# Altium project LightsDriver.PrjPcb
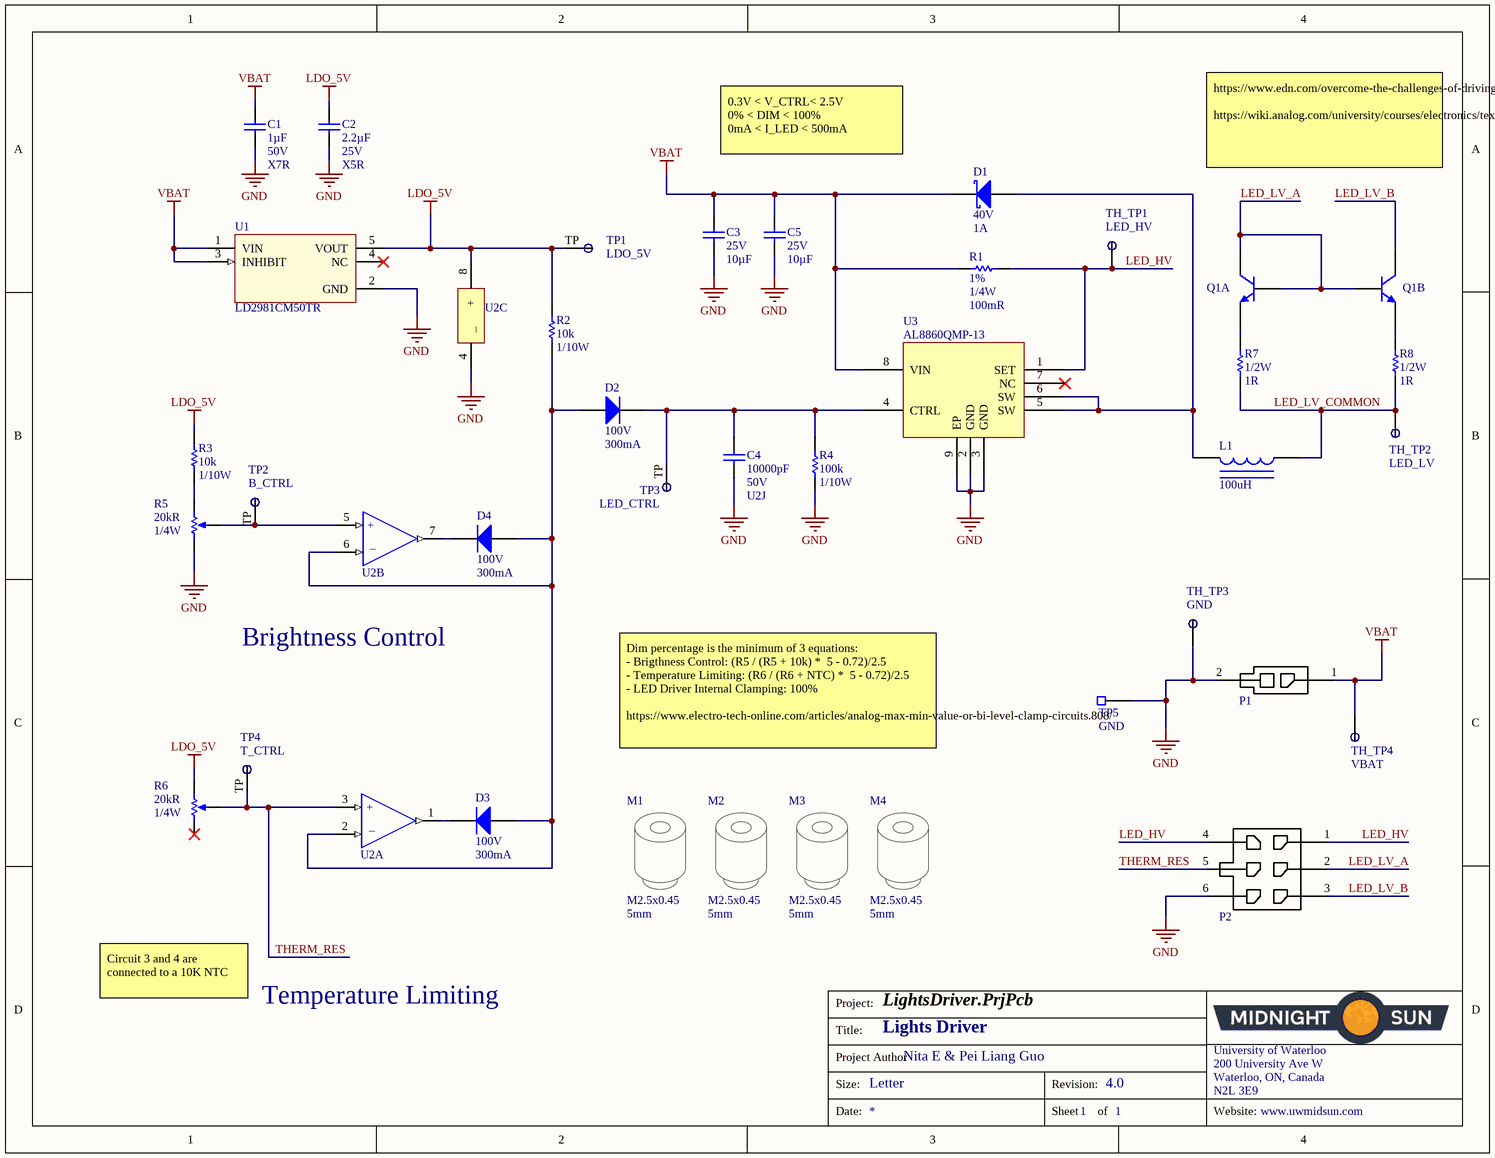
[diagram p0: LightsDriver.SchDoc]
ProjectAuthor: Nita E & Pei Liang Guo; ProjectRevision: 4.0
1 sheet, 37 parts. Net scope: global (net labels, ports and power ports of the same name join across sheets).
Board file: LightsDriver.PcbDoc

## Sheet LightsDriver.SchDoc: Lights Driver
size Letter; Organization: Midnight Sun Solar Rayce Car Team; Address1: University of Waterloo; Address2: 200 University Ave W; Address3: Waterloo, ON, Canada; Address4: N2L 3E9; Revision: 4.0; SheetNumber: 1; SheetTotal: 1; Website: www.uwmidsun.com

### Parts
C1  Capacitance: 1µF  Voltage: 50V  Temperature Coefficient: X7R  [CAP, 0603]  (hidden comment: CAP CER 1UF 50V 10% X7R 0603)
C2  Capacitance: 2.2µF  Voltage: 25V  Temperature Coefficient: X5R  [CAP, 0603]  (hidden comment: CAP CER 2.2UF 25V 10% X5R 0603)
C3  Voltage - Rated: 25V  Capacitance: 10µF  [CAP, 0805]  (hidden comment: CAP CER 10uF 25V 10% X5R 0805)
C4  Capacitance: 10000pF  Voltage: 50V  Temperature Coefficient: U2J  [CAP, 0603]  (hidden comment: CAP CER 10nF 50V 5% X7R 0603)
C5  Voltage - Rated: 25V  Capacitance: 10µF  [CAP, 0805]  (hidden comment: CAP CER 10uF 25V 10% X5R 0805)
D1  Max Reverse Voltage (DC): 40V  Average Rectified Current: 1A  [DIODE SOD123]  (hidden comment: DIODE SCHOTTKY 40V 1A SOD123F)
D2  Max Repetitive Reverse Voltage (Vrrm): 100V  Forward Current: 300mA  [DIODE GEN PURP 100V 300MA SOD123]  (hidden comment: DIODE GEN PURP 100V 300MA SOD123)
D3  Max Repetitive Reverse Voltage (Vrrm): 100V  Forward Current: 300mA  [DIODE GEN PURP 100V 300MA SOD123]  (hidden comment: DIODE GEN PURP 100V 300MA SOD123)
D4  Max Repetitive Reverse Voltage (Vrrm): 100V  Forward Current: 300mA  [DIODE GEN PURP 100V 300MA SOD123]  (hidden comment: DIODE GEN PURP 100V 300MA SOD123)
L1  Inductance: 100uH  [IND 100UH 1.2A 220MOHM SMD]  (hidden comment: IND 100UH 1.2A 220MOHM SMD)
M1  Screw-Thread Size: M2.5x0.45  Standoff Height: 5mm  [M2.5 Standoff]  (hidden comment: STANDOFF RND M2.5X0.45 STEEL 5MM)
M2  Screw-Thread Size: M2.5x0.45  Standoff Height: 5mm  [M2.5 Standoff]  (hidden comment: STANDOFF RND M2.5X0.45 STEEL 5MM)
M3  Screw-Thread Size: M2.5x0.45  Standoff Height: 5mm  [M2.5 Standoff]  (hidden comment: STANDOFF RND M2.5X0.45 STEEL 5MM)
M4  Screw-Thread Size: M2.5x0.45  Standoff Height: 5mm  [M2.5 Standoff]  (hidden comment: STANDOFF RND M2.5X0.45 STEEL 5MM)
P1  TO PWR DISTR  [CONN, 2POS MICRO-FIT R/A 2ROW]  (value not drawn)
P2  CONN 6POS MICRO-FIT R/A 2ROW 3mm  [CONN, 6POS MICRO-FIT R/A 2ROW]  (value not drawn)
Q1  BJT NPN DUAL 80V 1A 6-TSOP  [TSOP6 (SOT457)]  (value not drawn)  (parts A,B of 2)
R1  Tolerance: 1%  Power Rating: 1/4W  Resistance: 100mR  [RES 1206]  (hidden comment: RES 0.1 OHM 1% 1/4W 1206)
R2  Resistance: 10k  Power: 1/10W  [RES, 0603]  (hidden comment: RES 10K OHM 1% 1/10W 0603)
R3  Resistance: 10k  Power: 1/10W  [RES, 0603]  (hidden comment: RES 10K OHM 1% 1/10W 0603)
R4  Resistance: 100k  Power: 1/10W  [RES, 0603]  (hidden comment: RES 100K OHM 5% 1/8W 0603)
R5  Resistance: 20kR  Power Rating: 1/4W  [POT TRIMMER 20K]  (hidden comment: POT 20k OHM 20% 1/4W SMD)
R6  Resistance: 20kR  Power Rating: 1/4W  [POT TRIMMER 20K]  (hidden comment: POT 20k OHM 20% 1/4W SMD)
R7  Max Power Dissipation: 1/2W  Resistance: 1R  [RES 1206]  (hidden comment: RES 1 OHM 1% 1/2W 1206)
R8  Max Power Dissipation: 1/2W  Resistance: 1R  [RES 1206]  (hidden comment: RES 1 OHM 1% 1/2W 1206)
TH_TP1  LED_HV  [Thru Test Point]
TH_TP2  LED_LV  [Thru Test Point]
TH_TP3  GND  [Thru Test Point]
TH_TP4  VBAT  [Thru Test Point]
TP1  LDO_5V  [Test Point]  (no BOM)
TP2  B_CTRL  [Test Point]  (no BOM)
TP3  LED_CTRL  [Test Point]  (no BOM)
TP4  T_CTRL  [Test Point]  (no BOM)
TP5  GND  [TEST POINT 0603 SMD]
U1  Manufacturer Part Number 1: LD2981CM50TR  [SOT95P280X145-5N]  (hidden comment: IC REG LDO 5V 0.1A SOT23-5)
U2  IC OP AMP DUAL GP RR 10MHZ 8-VSSOP  [IC OP AMP DUAL 8-VSSOP]  (value not drawn)  (parts A,B,C of 3)
U3  Manufacturer Part Number: AL8860QMP-13  [IC LED DRIVER AL8860Q 8-MSOP-EP]  (hidden comment: IC LED DRIVER AL8860Q MSOP-8EP)

### Nets
GND: C1.2 C2.2 C3.2 C4.2 C5.2 P1.2 P2.6 R4.2 R5.1(TOP) TH_TP3.TH_TP TP5.1 U1.2(GND) U2.4(_) U3.2(GND) U3.3(GND) U3.9(EP)
LDO_5V: C2.1 R2.1 R3.1 R6.3(BOT) TP1.TP U1.5(VOUT) U2.8(+)
VBAT: C1.1 C3.1 C5.1 D1.1 P1.1 R1.1 TH_TP4.TH_TP U1.1(VIN) U1.3(INHIBIT) U3.8(VIN)
LED_HV: P2.1 P2.4 R1.2 TH_TP1.TH_TP U3.1(SET)
LED_LV_A: P2.2 Q1.1(B1) Q1.2(B2) Q1.6(C1)
LED_LV_B: P2.3 Q1.3(C2)
LED_LV_COMMON: L1.1 R7.2 R8.2 TH_TP2.TH_TP
THERM_RES: P2.5 R6.2(TAP) TP4.TP U2.3(+IN_A)
NetC4_1: C4.1 D2.1(CATHODE) R4.1 TP3.TP U3.4(CTRL)
NetD1_2: D1.2 L1.2 U3.5(SW) U3.6(SW)
NetD2_2: D2.2(ANODE) D3.2(ANODE) D4.2(ANODE) R2.2 U2.2(-IN_A) U2.6(-IN_B)
NetD3_1: D3.1(CATHODE) U2.1(OUT_A)
NetD4_1: D4.1(CATHODE) U2.7(OUT_B)
NetQ1_4: Q1.4(E2) R8.1
NetQ1_5: Q1.5(E1) R7.1
NetR3_2: R3.2 R5.3(BOT)
NetR5_2: R5.2(TAP) TP2.TP U2.5(+IN_B)

Not connected (* = marked no-connect by the designer): R6 1(TOP)*; U1 4(NC)*; U3 7(NC)*

### Notes on the sheet
- 0.3V < V_CTRL< 2.5V
  0% < DIM < 100%
  0mA < I_LED < 500mA
- https://www.edn.com/overcome-the-challenges-of-driving-parallel-led-strings/
  https://wiki.analog.com/university/courses/electronics/text/chapter-11
- Brightness Control
- Dim percentage is the minimum of 3 equations:
  - Brigthness Control: (R5 / (R5 + 10k) *  5 - 0.72)/2.5
  - Temperature Limiting: (R6 / (R6 + NTC) *  5 - 0.72)/2.5
  - LED Driver Internal Clamping: 100%
  https://www.electro-tech-online.com/articles/analog-max-min-value-or-bi-level-clamp-circuits.808/
- Circuit 3 and 4 are connected to a 10K NTC
- Temperature Limiting
- Project:
- Title:
- Size:
- Project Author
- Letter
- Revision:
- University of Waterloo
- 200 University Ave W
- Waterloo, ON, Canada
- N2L 3E9
- Date:
- Sheet
- of
- Website:

### Library data of the parts
C1 = CAP CER 1UF 50V 10% X7R 0603: 1µF ±10% 50V Ceramic Capacitor X7R 0603 (1608 Metric); Manufacturer 1: Taiyo Yuden; Manufacturer Part Number 1: UMK107AB7105KA-T; Supplier 1: Digi-Key; Supplier Part Number 1: 587-3247-1-ND; Packaging: Cut Tape (CT); Part Status: Active; Operating Temperature: -55°C ~ 125°C; Ratings: -; Mounting Type: Surface Mount, MLCC; Package / Case: 0603 (1608 Metric); Size / Dimension: 0.063" L x 0.031" W (1.60mm x 0.80mm); Height - Seated (Max): -; Thickness (Max): 0.037" (0.95mm); Lead Spacing: -; Lead Style: -; ComponentLink1URL: http://www.yuden.co.jp/productdata/catalog/en/mlcc_all_e.pdf; ComponentLink1Description: http://www.yuden.co.jp/productdata/catalog/en/mlcc_all_e.pdf; Tolerance: ±10%
C2 = CAP CER 2.2UF 25V 10% X5R 0603: 2.2µF ±10% 25V Ceramic Capacitor X5R 0603 (1608 Metric); Manufacturer 1: Murata Electronics North America; Manufacturer Part Number 1: GRM188R61E225KA12D; Supplier 1: Digi-Key; Supplier Part Number 1: 490-10731-1-ND; Packaging: Cut Tape (CT); Part Status: Active; Operating Temperature: -55°C ~ 85°C; Ratings: -; Mounting Type: Surface Mount, MLCC; Package / Case: 0603 (1608 Metric); Size / Dimension: 0.063" L x 0.031" W (1.60mm x 0.80mm); Height - Seated (Max): -; Thickness (Max): 0.035" (0.90mm); Lead Spacing: -; Lead Style: -; ComponentLink1URL: http://www.murata.com/~/media/webrenewal/support/library/catalog/products/capacitor/mlcc/c02e.ashx; ComponentLink1Description: http://www.murata.com/~/media/webrenewal/support/library/catalog/products/capacitor/mlcc/c02e.ashx; Tolerance: ±10%
C3 C5 = CAP CER 10uF 25V 10% X5R 0805: 10µF ±10% 25V Ceramic Capacitor X5R 0805 (2012 Metric); Manufacturer: Murata Electronics North America; Manufacturer Part Number: GRM21BR61E106KA73L; Supplier 1: Digi-Key; RoHS: RoHS Compliant; Category: Capacitors; Stock 1: 1695157; Packaging: Cut Tape (CT); Part Status: Active; Tolerance: ±10%; Temperature Coefficient: X5R; Operating Temperature: -55°C ~ 85°C; Features: -; Ratings: -; Applications: General Purpose; Mounting Type: Surface Mount, MLCC; Package / Case: 0805 (2012 Metric); Size / Dimension: 0.079" L x 0.049" W (2.00mm x 1.25mm); Height - Seated (Max): -; Thickness (Max): 0.053" (1.35mm); Lead Spacing: -; Lead Style: -; ComponentLink1URL: http://search.murata.co.jp/Ceramy/image/img/A01X/G101/ENG/GRM21BR61E106KA73-01.pdf; ComponentLink1Description: http://search.murata.co.jp/Ceramy/image/img/A01X/G101/ENG/GRM21BR61E106KA73-01.pdf; Supplier Part Number 1: 490-5523-1-ND; Pricing 1: 1=0.3, 10=0.214, 100=0.1008, 500=0.07068, 1000=0.05851 (CAD)
C4 = CAP CER 10nF 50V 5% X7R 0603: 10000pF ±5% 50V Ceramic Capacitor U2J 0603 (1608 Metric); Manufacturer 1: KEMET; Manufacturer Part Number 1: C0603C103J5JAC7867; Supplier 1: Digi-Key; Supplier Part Number 1: 399-13384-1-ND; Packaging: Cut Tape (CT); Part Status: Active; Operating Temperature: -55°C ~ 125°C; Ratings: -; Failure Rate: -; Mounting Type: Surface Mount, MLCC; Package / Case: 0603 (1608 Metric); Size / Dimension: 0.063" L x 0.032" W (1.60mm x 0.80mm); Height - Seated (Max): -; Thickness (Max): 0.034" (0.87mm); Lead Spacing: -; Lead Style: -; ComponentLink1URL: http://www.kemet.com/docfinder?Partnumber=C0603C103J5JAC7867; ComponentLink1Description: http://www.kemet.com/docfinder?Partnumber=C0603C103J5JAC7867; Tolerance: ±5%
D1 = DIODE SCHOTTKY 40V 1A SOD123F: Manufacturer: ON Semiconductor / Fairchild; Manufacturer Part Number: SS14FL; Reverse Recovery Time: 5.695ns; Element Configuration: Single; Max Forward Surge Current (Ifsm): 40A; Supplier 1: Digi-Key; RoHS: Yes; Category: Rectifier Diodes; Stock 1: 36912; Pricing 1: 1=0.25000, 10=0.20900, 25=0.17480, 100=0.08540, 250=0.08400, 500=0.07120, 1000=0.04947 (USD); Mount: Surface Mount; Case/Package: SOD; Weight: 0.0276g; Packaging: Tape and Reel; Max Repetitive Reverse Voltage (Vrrm): 40V; ComponentLink1URL: http://www.farnell.com/datasheets/2552650.pdf?src-supplier=Farnell; ComponentLink1Description: http://www.farnell.com/datasheets/2552650.pdf?src-supplier=Farnell; ComponentLink2URL: https://www.onsemi.com/pub/Collateral/SS14FL-D.PDF?src-supplier=Digi-Key; ComponentLink2Description: https://www.onsemi.com/pub/Collateral/SS14FL-D.PDF?src-supplier=Digi-Key; ComponentLink3URL: https://www.fairchildsemi.com/datasheets/SS/SS13FL.pdf?src-supplier=Digi-Key; ComponentLink3Description: https://www.fairchildsemi.com/datasheets/SS/SS13FL.pdf?src-supplier=Digi-Key; Supplier Part Number 1: SS14FLCT-ND
D2-D4 = DIODE GEN PURP 100V 300MA SOD123: Diode Standard 100V 300mA (DC) Surface Mount SOD-123; Manufacturer: Diodes Zetex; Manufacturer Part Number: 1N4148WQ-7-F; Max Surge Current: 2A; Forward Voltage: 1.25V; Element Configuration: Single; Recovery Time: 4ns; Peak Reverse Current: 50uA; Max Power Dissipation: 400mW; Supplier 1: Digi-Key; Stock 1: 229; Pricing 1: 1=0.22, 10=0.196, 100=0.107, 500=0.0658, 1000=0.0449 (USD); Mount: Surface Mount; Case/Package: SOD-123-2; Number of Pins: 2; Weight: 0.000353oz; Contact Plating: Tin,Matte; Min Operating Temperature: -65°C; Max Operating Temperature: 150°C; Packaging: Tape and Reel; Peak Non-Repetitive Surge Current: 2A; Package Quantity: 3000; Reverse Recovery Time: 4ns; Lead Free: Lead Free; ComponentLink1URL: http://components.arrow.com/part/dataview/0323_07206809; ComponentLink1Description: http://components.arrow.com/part/dataview/0323_07206809; ComponentLink2URL: http://www.diodes.com/datasheets/ds30086.pdf; ComponentLink2Description: http://www.diodes.com/datasheets/ds30086.pdf; ComponentLink3URL: http://www.mouser.com/ds/2/115/ds30086-318161.pdf; ComponentLink3Description: http://www.mouser.com/ds/2/115/ds30086-318161.pdf; Supplier Part Number 1: 1N4148WQ-7-FDICT-ND
L1 = IND 100UH 1.2A 220MOHM SMD: Inductor Power Shielded Wirewound 100uH 30% 100KHz 26Q-Factor Ferrite 1.2A 220mOhm DCR Automotive T/R; Manufacturer: Bourns; Manufacturer Part Number: SRU1048A-101Y; DC Resistance (DCR): 220mR; Self Resonant Frequency: 5MHz; Saturation Current: 1A; Supplier 1: Digi-Key; RoHS: Yes; Category: Fixed Inductors; Stock 1: 69; Pricing 1: 1=1.17000, 10=1.08400, 100=0.78370 (USD); Mount: Surface Mount; Case/Package: Nonstandard; Core Material: Ferrite; Min Operating Temperature: -40°C; Max Operating Temperature: 125°C; Composition: Wirewound; Test Frequency: 100kHz; Military Standard: Not; RMS Current (Irms): 1.2A; Max DC Current: 1.2A; Inductance Tolerance: 30%; Packaging: Cut Tape; Tolerance: 30%; Shielding: Shielded; Package Quantity: 600; Current Rating: 1.2A; Length: 0.394inch; Height: 4.8mm; Height - Seated (Max): 0.201inch; Depth: 10.3mm; Width: 0.394inch; Ratings: AEC-Q200; REACH SVHC: No SVHC; ComponentLink1URL: https://datasheet.ciiva.com/48684/sru1048a-48684678.pdf?src-supplier=Avnet; ComponentLink1Description: https://datasheet.ciiva.com/48684/sru1048a-48684678.pdf?src-supplier=Avnet; ComponentLink2URL: https://datasheet.ciiva.com/41859/sru1048a-41859752.pdf?src-supplier=Digi-Key; ComponentLink2Description: https://datasheet.ciiva.com/41859/sru1048a-41859752.pdf?src-supplier=Digi-Key; Supplier Part Number 1: SRU1048A-101YCT-ND
M1-M4 = STANDOFF RND M2.5X0.45 STEEL 5MM: Manufacturer: Wurth Electronics; Manufacturer Part Number: 9774050151R; Plating: Tin; Threaded/Unthreaded: Threaded; Outside Diameter: 0.201inch; Supplier 1: Digi-Key; RoHS: Yes; Stock 1: 24846; Pricing 1: 1 = 1.09000, 10 = 1.03000, 50 = 0.91800, 100 = 0.84000 (USD); Material: Steel; Length: 0.252inch; REACH SVHC: Unknown; Supplier Part Number 1: 732-7095-1-ND
P1 = CONN 2POS MICRO-FIT R/A 2ROW 3mm: Header Connector, Pcb Mount, Recept, 2 Contacts, Pin, 0.118 Pitch, R Angle Pc Tail Terminal; Manufacturer: Molex; Manufacturer Part Number: 43045-0221; Connector Type: Male Pin; Contact Resistance: 10mR; Number of Positions: 2; Current Rating: 5A; Voltage Rating: 250V; Max Voltage Rating (DC): 250.25kV; Gender: Male; Pitch: 3mm; Row Spacing: 0.118inch; Glow Wire Compliant: Compliant; Supplier 1: Digi-Key; RoHS: Yes; Category: Headers and Wire Housings; Stock 1: 1557; Pricing 1: 1=1.19000, 10=1.04400, 100=0.90070, 500=0.73692, 3168=0.59363, 6336=0.57316, 12672=0.53222 (USD); Mount: Through Hole; Case/Package: Metal; Housing Material: Thermoplastic; Contact Material: Brass; Contact Plating: Tin; Color: Black; Min Operating Temperature: -40°C; Max Operating Temperature: 105°C; Number of Rows: 2; Packaging: Tray; Fastening Type: Ramp; Termination: Solder; Number of Contacts: 2; Orientation: Right Angle; Package Quantity: 1; Number of Circuits: 2; Halogen Free: Low Halogen; ComponentLink1URL: https://datasheet.ciiva.com/5152/0430450221-pcb-headers-142766-5152032.pdf?src-supplier=Mouser; ComponentLink1Description: https://datasheet.ciiva.com/5152/0430450221-pcb-headers-142766-5152032.pdf?src-supplier=Mouser; ComponentLink2URL: https://datasheet.ciiva.com/16725/0430450221-pcb-headers-16725479.pdf?src-supplier=Avnet+Europe; ComponentLink2Description: https://datasheet.ciiva.com/16725/0430450221-pcb-headers-16725479.pdf?src-supplier=Avnet+Europe; ComponentLink3URL: https://datasheet.ciiva.com/11752/0900766b80d438f8-11752889.pdf?src-supplier=RSComponents; ComponentLink3Description: https://datasheet.ciiva.com/11752/0900766b80d438f8-11752889.pdf?src-supplier=RSComponents; ComponentLink4URL: https://datasheet.ciiva.com/30062/187650430450221-pcb-headers-30062367.pdf?src-supplier=Onlinecomponents.com; ComponentLink4Description: https://datasheet.ciiva.com/30062/187650430450221-pcb-headers-30062367.pdf?src-supplier=Onlinecomponents.com; ComponentLink5URL: https://datasheet.ciiva.com/7920/1629737-7920746.pdf?src-supplier=Element14; ComponentLink5Description: https://datasheet.ciiva.com/7920/1629737-7920746.pdf?src-supplier=Element14; ComponentLink6URL: https://datasheet.ciiva.com/726/430450221-sd-726236.pdf?src-supplier=Digi-Key; ComponentLink6Description: https://datasheet.ciiva.com/726/430450221-sd-726236.pdf?src-supplier=Digi-Key; Supplier Part Number 1: WM2672-ND
P2 = CONN 6POS MICRO-FIT R/A 2ROW 3mm: Conn Wire to Board HDR 6 POS 3mm Solder RA Thru-Hole Micro-Fit 3.0™ Tray; Manufacturer: Molex; Manufacturer Part Number: 043045-0621; Voltage Rating (DC): 250V; Gender: Female; Number of Circuits: 6; Insulation Resistance: 1GR; Current Rating: 5A; Contact Resistance: 10mR; Connector Type: Male Pin; Row Spacing: 0.118inch; Glow Wire Compliant: Compliant; Supplier 1: Digi-Key; RoHS: Yes; Category: Headers and Wire Housings; Stock 1: 170; Pricing 1: 1=1.89000, 10=1.71500, 100=1.46960, 500=1.22466, 1000=1.04970, 5000=0.93073, 10000=0.90974 (USD); Mount: Through Hole; Housing Material: Polymer; Contact Plating: Tin; Contact Material: Brass; Color: Black; Housing Color: Black; Min Operating Temperature: -40°C; Max Operating Temperature: 105°C; Orientation: Right Angle; Number of Rows: 2; Packaging: Tray; Number of Positions: 6; Termination: Solder; Number of Contacts: 6; Fastening Type: Ramp; Length: 13.15mm; Pitch: 3mm; Depth: 12.2mm; Flammability Rating: UL94 V-0; Halogen Free: Low Halogen; ComponentLink1URL: http://components.arrow.com/part/dataview/2943185S8703233N3303?src-supplier=Arrow; ComponentLink1Description: http://components.arrow.com/part/dataview/2943185S8703233N3303?src-supplier=Arrow; ComponentLink2URL: http://components.arrow.com/part/dataview/0323_01056240?src-supplier=Arrow+Europe; ComponentLink2Description: http://components.arrow.com/part/dataview/0323_01056240?src-supplier=Arrow+Europe; ComponentLink3URL: https://www.molex.com/pdm_docs/sd/430450221_sd.pdf?src-supplier=Digi-Key; ComponentLink3Description: https://www.molex.com/pdm_docs/sd/430450221_sd.pdf?src-supplier=Digi-Key; Supplier Part Number 1: WM2674-ND
Q1 = BJT NPN DUAL 80V 1A 6-TSOP: Bipolar (BJT) Transistor Array 2 PNP (Dual) Matched Pair 80V 1A 140MHz 500mW Surface Mount 6-TSOP; Manufacturer: Nexperia; Manufacturer Part Number: BCM56DSF; Supplier 1: Digi-Key; RoHS: No; Stock 1: 9949; Pricing 1: 1=0.35000, 10=0.28200, 25=0.25800, 100=0.16200, 250=0.16020, 500=0.15000, 1000=0.10200, 2500=0.09780, 5000=0.09000 (USD); Supplier Part Number 1: 1727-7829-1-ND
R1 = RES 0.1 OHM 1% 1/4W 1206: Res Thick Film 1206 0.1 Ohm 1% 0.25W(1/4W) ±600ppm/C Molded SMD Paper T/R; Manufacturer: Yageo; Manufacturer Part Number: RL1206FR-070R1L; Max Power Dissipation: 250mW; Temperature Coefficient: 600ppm/°C; Supplier 1: Digi-Key; RoHS: Yes; Category: Chip SMD Resistors; Stock 1: 37786; Pricing 1: 1=0.38000, 10=0.29200, 100=0.12250, 1000=0.06760, 2500=0.06338 (USD); Case/Package: 1206; Contact Plating: Tin,Lead; Case Code (Metric): 3216; Case Code (Imperial): 1206; Min Operating Temperature: -55°C; Max Operating Temperature: 125°C; Features: Moisture Resistant; Composition: Thick Film; Number of Terminations: 2; Termination: SMD/SMT; Military Standard: Not; Package Quantity: 1; Packaging: Tape and Reel; Length: 3.1mm; Height: 0.026inch; Depth: 1.6mm; Width: 0.063inch; Lead Free: Lead Free; REACH SVHC: Unknown; ComponentLink1URL: https://datasheet.ciiva.com/5558/pyu-rl-hp-521-rohs-l-2-5558071.pdf?src-supplier=Mouser; ComponentLink1Description: https://datasheet.ciiva.com/5558/pyu-rl-hp-521-rohs-l-2-5558071.pdf?src-supplier=Mouser; ComponentLink2URL: https://datasheet.ciiva.com/22699/877049-22699038.pdf?src-supplier=Element14; ComponentLink2Description: https://datasheet.ciiva.com/22699/877049-22699038.pdf?src-supplier=Element14; Supplier Part Number 1: 311-0.1LWCT-ND
R2 R3 = RES 10K OHM 1% 1/10W 0603: RES SMD 10K OHM 1% 1/10W 0603; Manufacturer 1: Yageo; Manufacturer Part Number 1: RC0603FR-0710KL; Temperature Coefficient: ±100ppm/°C; Supplier 1: Digi-Key; Supplier Part Number 1: 311-10.0KHRCT-ND; Packaging: Cut Tape (CT); Part Status: Active; Composition: Thick Film; Operating Temperature: -55°C ~ 155°C; Package / Case: 0603 (1608 Metric); Supplier Device Package: 0603; Size / Dimension: 0.063" L x 0.031" W (1.60mm x 0.80mm); Height - Seated (Max): 0.022" (0.55mm); Failure Rate: -; ComponentLink1URL: http://www.yageo.com/documents/recent/PYu-RC_Group_51_RoHS_L_7.pdf; ComponentLink1Description: http://www.yageo.com/documents/recent/PYu-RC_Group_51_RoHS_L_7.pdf; Tolerance: ±1%
R4 = RES 100K OHM 5% 1/8W 0603: RES SMD 100K OHM 5% 1/10W 0603; Manufacturer 1: Yageo; Manufacturer Part Number 1: RC0603JR-07100KL; Temperature Coefficient: ±100ppm/°C; Supplier 1: Digi-Key; Supplier Part Number 1: 311-100KGRCT-ND; Packaging: Cut Tape (CT); Part Status: Active; Composition: Thick Film; Operating Temperature: -55°C ~ 155°C; Package / Case: 0603 (1608 Metric); Supplier Device Package: 0603; Size / Dimension: 0.063" L x 0.031" W (1.60mm x 0.80mm); Height - Seated (Max): 0.022" (0.55mm); Failure Rate: -; ComponentLink1URL: http://www.yageo.com/documents/recent/PYu-RC_Group_51_RoHS_L_7.pdf; ComponentLink1Description: http://www.yageo.com/documents/recent/PYu-RC_Group_51_RoHS_L_7.pdf; Tolerance: ±5%
R5 R6 = POT 20k OHM 20% 1/4W SMD: 20 kOhms 0.25W, 1/4W Gull Wing Surface Mount Trimmer Potentiometer Cermet 1 Turn Top Adjustment; Manufacturer: TT BI; Manufacturer Part Number: 23BR20KLFTR; Voltage Rating: 200V; Max Power Dissipation: 250mW; Number of Turns: 1; Insulation Resistance: 100MR; Temperature Coefficient: 100ppm/°C; Supplier 1: Digi-Key; RoHS: Yes; Category: Variable Resistors and Potentiometers; Stock 1: 2071; Pricing 1: 1=1.27000, 10=1.12200, 25=1.01000, 50=0.97240, 100=0.93500, 250=0.87892 (USD); Mount: Surface Mount; Weight: 0.004938oz; Min Operating Temperature: -55°C; Max Operating Temperature: 125°C; Package Quantity: 1; Tolerance: 20%; Packaging: Tape and Reel; Voltage Rating (DC): 200V; Termination: Gull Wing; Military Standard: Not; Composition: Cermet; Type: Potentiometer; Length: 5mm; Height: 0.106inch; Width: 4.5mm; Depth: 6.2mm; Radiation Hardening: No; REACH SVHC: No SVHC; Lead Free: Lead Free; ComponentLink1URL: https://datasheet.ciiva.com/3890/42287794s7870631n1290-3890844.pdf?src-supplier=Arrow; ComponentLink1Description: https://datasheet.ciiva.com/3890/42287794s7870631n1290-3890844.pdf?src-supplier=Arrow; ComponentLink2URL: https://datasheet.ciiva.com/1130/4708-1130034.pdf?src-supplier=Element14; ComponentLink2Description: https://datasheet.ciiva.com/1130/4708-1130034.pdf?src-supplier=Element14; ComponentLink3URL: https://datasheet.ciiva.com/14186/tz23-b-dat-e-14186231.pdf?src-supplier=Distrelec; ComponentLink3Description: https://datasheet.ciiva.com/14186/tz23-b-dat-e-14186231.pdf?src-supplier=Distrelec; Supplier Part Number 1: 987-1016-1-ND
R7 R8 = RES 1 OHM 1% 1/2W 1206: BOURNS - CRM1206AFX-1R00ELF - RES, 1R, 1%, 1206, THICK FILM; Temperature Coefficient: 100ppm/°C; Supplier 1: Digi-Key; Manufacturer: Bourns; Manufacturer Part Number: CRM1206AFX-1R00ELF; RoHS: No; Stock 1: 9624; Pricing 1: 1=0.14000, 10=0.12100, 100=0.04730, 1000=0.01980, 2500=0.01815 (USD); Case/Package: 1206; Case Code (Imperial): 1206; Case Code (Metric): 3216; Min Operating Temperature: -55°C; Max Operating Temperature: 155°C; Composition: Thick Film; Features: Automotive AEC-Q200,Anti-Sulfur; Packaging: Cut Tape; Number of Terminations: 2; ComponentLink1URL: http://www.farnell.com/datasheets/2552937.pdf?src-supplier=Farnell; ComponentLink1Description: http://www.farnell.com/datasheets/2552937.pdf?src-supplier=Farnell; ComponentLink2URL: https://www.bourns.com/docs/product-datasheets/crm-a.pdf?src-supplier=Digi-Key; ComponentLink2Description: https://www.bourns.com/docs/product-datasheets/crm-a.pdf?src-supplier=Digi-Key; ComponentLink3URL: http://www.farnell.com/datasheets/2552937.pdf?src-supplier=Newark; ComponentLink3Description: http://www.farnell.com/datasheets/2552937.pdf?src-supplier=Newark; ComponentLink4URL: http://www.farnell.com/datasheets/2552937.pdf?src-supplier=Element14; ComponentLink4Description: http://www.farnell.com/datasheets/2552937.pdf?src-supplier=Element14; Supplier Part Number 1: CRM1206AFX-1R00ELFCT-ND; Tolerance: 1%
TH_TP1-TH_TP4 = Thru Test Point
TP1-TP4 = Test Point
TP5 = Test Point 0603 SMD: Manufacturer 1: TE Connectivity; Manufacturer Part Number 1: 1625854-3; Description 1: Thick Film Resistors - SMD 2000; Resistance: 0mR; Supplier 1: Digi-Key; Supplier Part Number 1: A106145CT-ND; Stock 1: 212628; Pricing 1: 1=0.22, 10=0.211, 25=0.18, 50=0.1574, 100=0.1462, 250=0.12932, 500=0.12368, 1000=0.1012 (USD); Mount: Surface Mount; Case/Package: 0603; Colour: Natural; Case Code (Imperial): 0603; Case Code (Metric): 1608; Min Operating Temperature: -55°C; Max Operating Temperature: 125°C; Packaging: Tape and Reel; Termination: SMD/SMT; Package Quantity: 2000; Military Standard: Not; Length: 1.6mm; Height: 1.15mm; Width: 0.8mm; Depth: 0.8mm; Radiation Hardening: No; ComponentLink1URL: https://datasheet.ciiva.com/30100/1773266-a-30100967.pdf; ComponentLink1Description: https://datasheet.ciiva.com/30100/1773266-a-30100967.pdf; ComponentLink2URL: https://datasheet.ciiva.com/8914/eng-ds-1773266-a-8914634.pdf; ComponentLink2Description: https://datasheet.ciiva.com/8914/eng-ds-1773266-a-8914634.pdf; ComponentLink3URL: https://datasheet.ciiva.com/6439/eng-ds-1773266-a-6439163.pdf; ComponentLink3Description: https://datasheet.ciiva.com/6439/eng-ds-1773266-a-6439163.pdf; ComponentLink4URL: https://datasheet.ciiva.com/6439/eng-ds-1773266-a-6439164.pdf; ComponentLink4Description: https://datasheet.ciiva.com/6439/eng-ds-1773266-a-6439164.pdf; ComponentLink5URL: https://datasheet.ciiva.com/6439/eng-ds-1773266-a-6439165.pdf; ComponentLink5Description: https://datasheet.ciiva.com/6439/eng-ds-1773266-a-6439165.pdf
U1 = IC REG LDO 5V 0.1A SOT23-5: Linear Voltage Regulator IC Positive Fixed Output 5V 100mA SOT-23-5; Manufacturer 1: STMicroelectronics; Voltage - Dropout (Typical): 0.18V @ 100mA; Voltage - Input: Up to 16V; Supplier 1: Digi-Key; Supplier Part Number 1: 497-7787-1-ND; Packaging: Cut Tape (CT); Part Status: Active; Regulator Topology: Positive Fixed; Voltage - Output: 5V; Current - Output: 100mA; Current - Limit (Min): -; Operating Temperature: -40°C ~ 125°C; Mounting Type: Surface Mount; Package / Case: SC-74A, SOT-753; Supplier Device Package: SOT-23-5; ComponentLink1URL: http://www.st.com/content/ccc/resource/technical/document/datasheet/group1/b7/b5/a1/83/9c/bd/4a/90/CD00001635/files/CD00001635.pdf/jcr:content/translations/en.CD00001635.pdf; ComponentLink1Description: http://www.st.com/content/ccc/resource/technical/document/datasheet/group1/b7/b5/a1/83/9c/bd/4a/90/CD00001635/files/CD00001635.pdf/jcr:content/translations/en.CD00001635.pdf
U2 = IC OP AMP DUAL GP RR 10MHZ 8-VSSOP: General Purpose Amplifier 2 Circuit Rail-to-Rail 8-VSSOP; Manufacturer: Texas Instruments; Manufacturer Part Number: OPA2197IDGKR; Number of Circuits: 2; Slew Rate: 20V/µs; Input Bias Current: 5pA; Input Offset Voltage (Vos): 250uV; Operating Supply Current: 1mA; Output Current per Channel: 65mA; Supplier 1: Digi-Key; Stock 1: 2171; Pricing 1: 1=2.41, 10=2.162, 100=1.7376, 500=1.4276, 1000=1.1829 (USD); Mount: Surface Mount; Case/Package: VSSOP; Min Operating Temperature: -40°C; Max Operating Temperature: 125°C; Packaging: Tape and Reel; Gain Bandwidth Product: 10MHz; Number of Channels: 2; Lead Free: Lead Free; ComponentLink1URL: http://www.ti.com/lit/ds/symlink/opa2197.pdf; ComponentLink1Description: http://www.ti.com/lit/ds/symlink/opa2197.pdf; Supplier Part Number 1: 296-47349-1-ND
U3 = IC LED DRIVER AL8860Q MSOP-8EP: AL8860 Series 40 V 1.5 A SMT High Efficiency Buck LED Driver - MSOP-8EP; Manufacturer: Diodes; Supplier 1: Digi-Key; RoHS: No; Stock 1: 2189; Pricing 1: 1=0.57000, 10=0.50000, 25=0.46960, 100=0.35600, 250=0.30300, 500=0.28786, 1000=0.21968 (USD); Supplier Part Number 1: AL8860QMP-13DICT-ND

## Assembly variants
01 - Standard: not fitted C4 C5
02 - Soft Start: not fitted C5